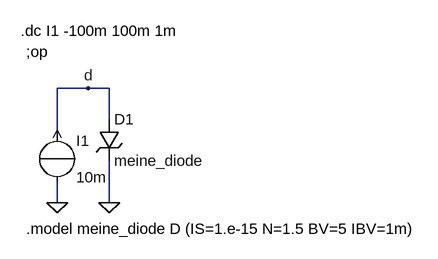
[diagram p0: schematic z-diode-kennlinie.asc]
z-diode-kennlinie.asc, the LTspice schematic file:
Version 4
SHEET 1 880 680
WIRE 224 96 176 96
WIRE 256 96 224 96
WIRE 256 144 256 96
WIRE 176 160 176 96
WIRE 176 272 176 240
WIRE 256 272 256 208
FLAG 176 272 0
FLAG 256 272 0
FLAG 224 96 d
SYMBOL zener 240 144 R0
SYMATTR InstName D1
SYMATTR Value meine_diode
SYMATTR Description Diode
SYMATTR Type diode
SYMBOL source-I 176 160 R0
SYMATTR InstName I1
SYMATTR Value 10m
TEXT 128 40 Left 2 !;op
TEXT 120 8 Left 2 !.dc I1 -100m 100m 1m
TEXT 128 312 Left 2 !.model meine_diode D (IS=1.e-15 N=1.5 BV=5 IBV=1m)

The netlist it stands for:
* z-diode-kennlinie.asc
D1 d 0 meine_diode
I1 0 d 10m
.model D D
.lib standard.dio
;op
.dc I1 -100m 100m 1m
.model meine_diode D (IS=1.e-15 N=1.5 BV=5 IBV=1m)
.backanno
.end